# EAGLE design Schematic_Novek (EAGLE 9.6.2)

## Sheet 1 of 3
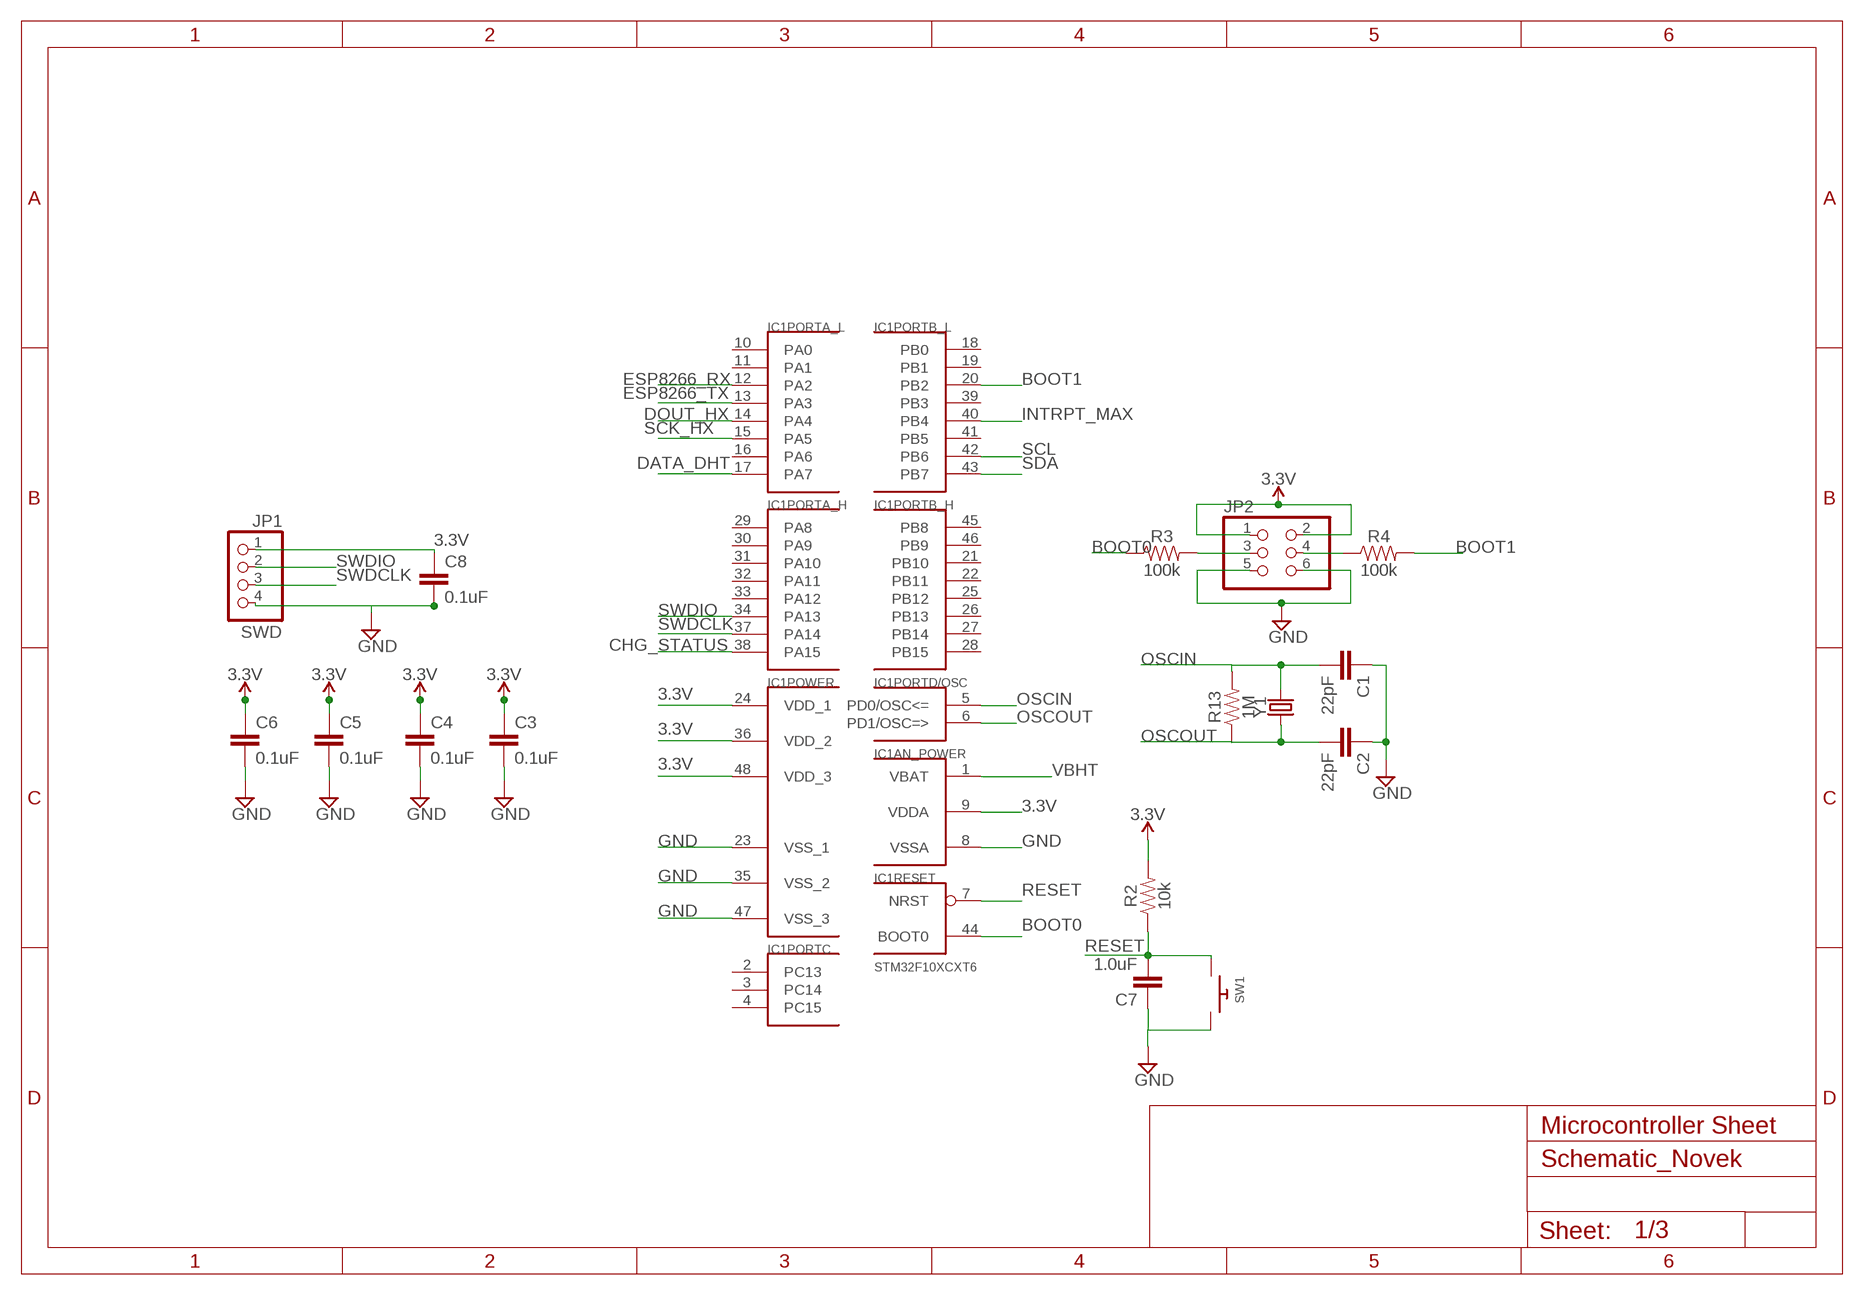
[diagram p0: schematic, sheet 1]

### Parts
C1  22pF  22PF-0603-50V-5%  [0603]
C2  22pF  22PF-0603-50V-5%  [0603]
C3  0.1uF  0.1UF-0603-25V-(+80/-20%)  [0603]
C4  0.1uF  0.1UF-0603-25V-(+80/-20%)  [0603]
C5  0.1uF  0.1UF-0603-25V-(+80/-20%)  [0603]
C6  0.1uF  0.1UF-0603-25V-(+80/-20%)  [0603]
C7  1.0uF  1.0UF-0603-16V-10%  [0603]
C8  0.1uF  0.1UF-0603-25V-(+80/-20%)  [0603]
IC1  STM32F10XCXT6  [TQFP48]
JP1  SWD  PINHD-1X4/90  [1X04/90]
JP2  PINHD-2X3  [2X03]
R2  10k  10KOHM-0603-1/10W-1%  [0603]
R3  100k  100KOHM-0603-1/10W-1%  [0603]
R4  100k  100KOHM-0603-1/10W-1%  [0603]
R13  1M  1MOHM-0603-1/4W-5%  [0603]
SW1  SWITCH_PUSHBUTTONC&K_KSS  [BTN_CK_KSS]
Y1  CRYSTALPTH-HC49UV  [HC49U]

### Nets
3.3V: C3.1 C4.1 C5.1 C6.1 C8.1 IC1.9(AN_POWER:VDDA) IC1.24(POWER:VDD_1) IC1.36(POWER:VDD_2) IC1.48(POWER:VDD_3) JP1.1 JP2.1 JP2.2 R2.2 ; also sheet 2,3
BOOT0: IC1.44(RESET:BOOT0) R3.1
BOOT1: IC1.20(PORTB_L:PB2) R4.2
CHG_STATUS: IC1.38(PORTA_H:PA15) ; also sheet 2
DATA_DHT: IC1.17(PORTA_L:PA7) ; also sheet 3
DOUT_HX: IC1.14(PORTA_L:PA4) ; also sheet 3
ESP8266_RX: IC1.12(PORTA_L:PA2) ; also sheet 3
ESP8266_TX: IC1.13(PORTA_L:PA3) ; also sheet 3
GND: C1.1 C2.1 C3.2 C4.2 C5.2 C6.2 C7.1 C8.2 IC1.8(AN_POWER:VSSA) IC1.23(POWER:VSS_1) IC1.35(POWER:VSS_2) IC1.47(POWER:VSS_3) JP1.4 JP2.5 JP2.6 SW1.P$2 ; also sheet 2,3
INTRPT_MAX: IC1.40(PORTB_L:PB4) ; also sheet 2
N$3: JP2.3 R3.2
N$4: JP2.4 R4.1
OSCIN: C1.2 IC1.5(PORTD/OSC:PD0/OSC<=) R13.2 Y1.2
OSCOUT: C2.2 IC1.6(PORTD/OSC:PD1/OSC=>) R13.1 Y1.1
RESET: C7.2 IC1.7(RESET:NRST) R2.1 SW1.P$1
SCK_HX: IC1.15(PORTA_L:PA5) ; also sheet 3
SCL: IC1.42(PORTB_L:PB6) ; also sheet 2,3
SDA: IC1.43(PORTB_L:PB7) ; also sheet 2,3
SWDCLK: IC1.37(PORTA_H:PA14) JP1.3
SWDIO: IC1.34(PORTA_H:PA13) JP1.2
VBHT: IC1.1(AN_POWER:VBAT)
Unconnected: IC1.2(PORTC:PC13) IC1.3(PORTC:PC14) IC1.4(PORTC:PC15) IC1.10(PORTA_L:PA0) IC1.11(PORTA_L:PA1) IC1.16(PORTA_L:PA6) IC1.18(PORTB_L:PB0) IC1.19(PORTB_L:PB1) IC1.21(PORTB_H:PB10) IC1.22(PORTB_H:PB11) IC1.25(PORTB_H:PB12) IC1.26(PORTB_H:PB13) IC1.27(PORTB_H:PB14) IC1.28(PORTB_H:PB15) IC1.29(PORTA_H:PA8) IC1.30(PORTA_H:PA9) IC1.31(PORTA_H:PA10) IC1.32(PORTA_H:PA11) IC1.33(PORTA_H:PA12) IC1.39(PORTB_L:PB3) IC1.41(PORTB_L:PB5) IC1.45(PORTB_H:PB8) IC1.46(PORTB_H:PB9)

### Notes on the sheet
- Microcontroller Sheet

## Sheet 2 of 3
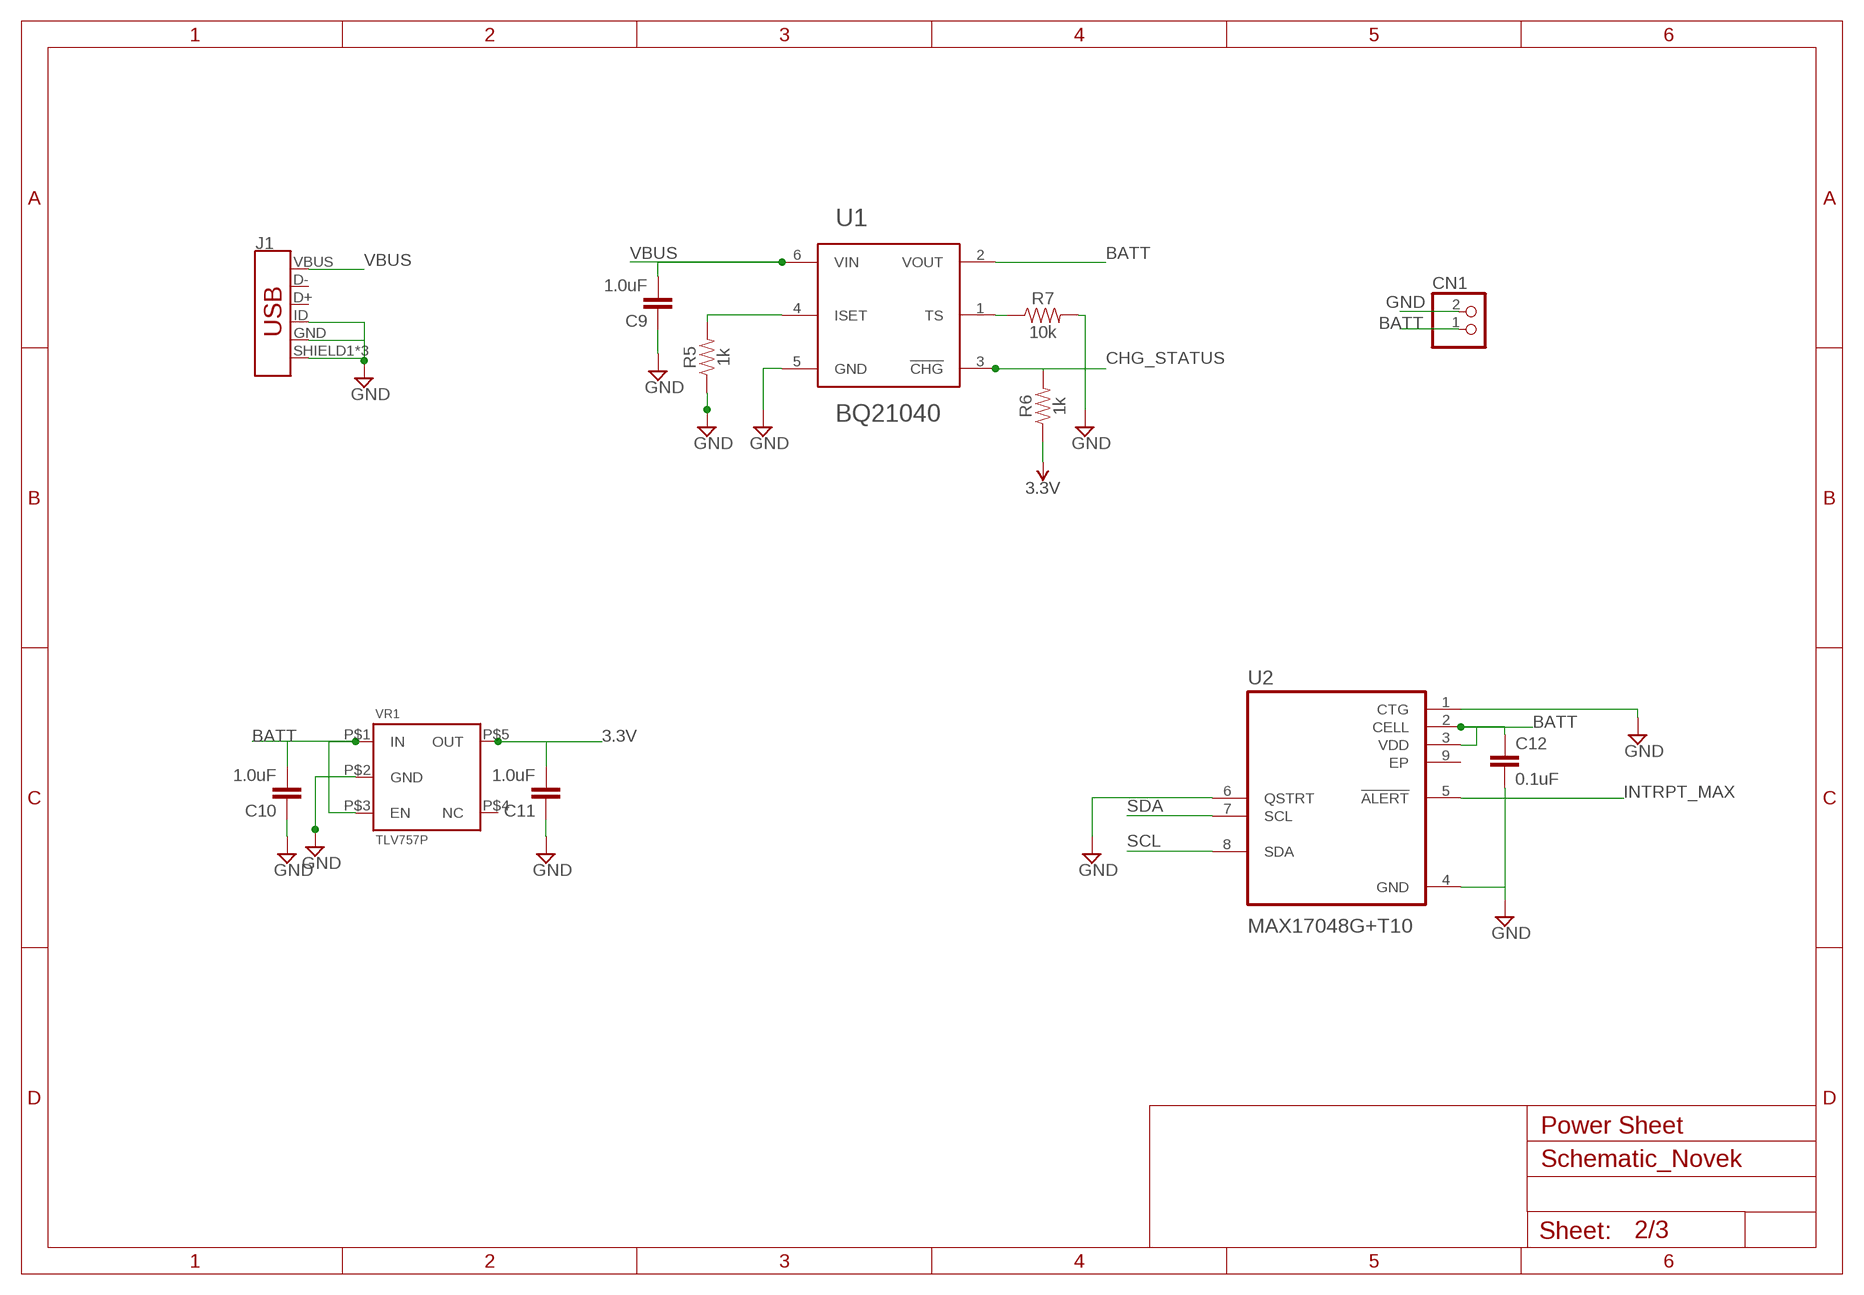
[diagram p1: schematic, sheet 2]

### Parts
C9  1.0uF  1.0UF-0603-16V-10%  [0603]
C10  1.0uF  1.0UF-0603-16V-10%  [0603]
C11  1.0uF  1.0UF-0603-16V-10%  [0603]
C12  0.1uF  0.1UF-0603-25V-(+80/-20%)  [0603]
CN1  JST_2PIN-THM  [JST-PH-2-THM]
J1  USB_MICRO-B_FEMALE-SMT  [USB-B-MICRO-SMD]
R5  1k  1KOHM-0603-1/10W-1%  [0603]
R6  1k  1KOHM-0603-1/10W-1%  [0603]
R7  10k  10KOHM-0603-1/10W-1%  [0603]
U1  BQ21040  [SOT23-6]
U2  MAX17048G+T10  [SON50P200X200X80-9N]
VR1  TLV757P  [TLV757P]

### Nets
3.3V: C11.2 R6.1 VR1.P$5(OUT) ; also sheet 1,3
BATT: C10.2 C12.1 CN1.1 U1.2(VOUT) U2.2(CELL) U2.3(VDD) VR1.P$1(IN) VR1.P$3(EN)
CHG_STATUS: R6.2 U1.3(!CHG!) ; also sheet 1
GND: C9.1 C10.1 C11.1 C12.2 CN1.2 J1.GND J1.ID J1.SHIELD1(SHIELD) J1.SHIELD2(SHIELD) J1.SHIELD3(SHIELD) R5.1 R7.2 U1.5(GND) U2.1(CTG) U2.4(GND) U2.6(QSTRT) VR1.P$2(GND) ; also sheet 1,3
INTRPT_MAX: U2.5(!ALERT) ; also sheet 1
N$1: R5.2 U1.4(ISET)
N$2: R7.1 U1.1(TS)
SCL: U2.8(SDA) ; also sheet 1,3
SDA: U2.7(SCL) ; also sheet 1,3
VBUS: C9.2 J1.VBUS U1.6(VIN)
Unconnected: J1.D+ J1.D- VR1.P$4(NC)

### Notes on the sheet
- Power Sheet

## Sheet 3 of 3
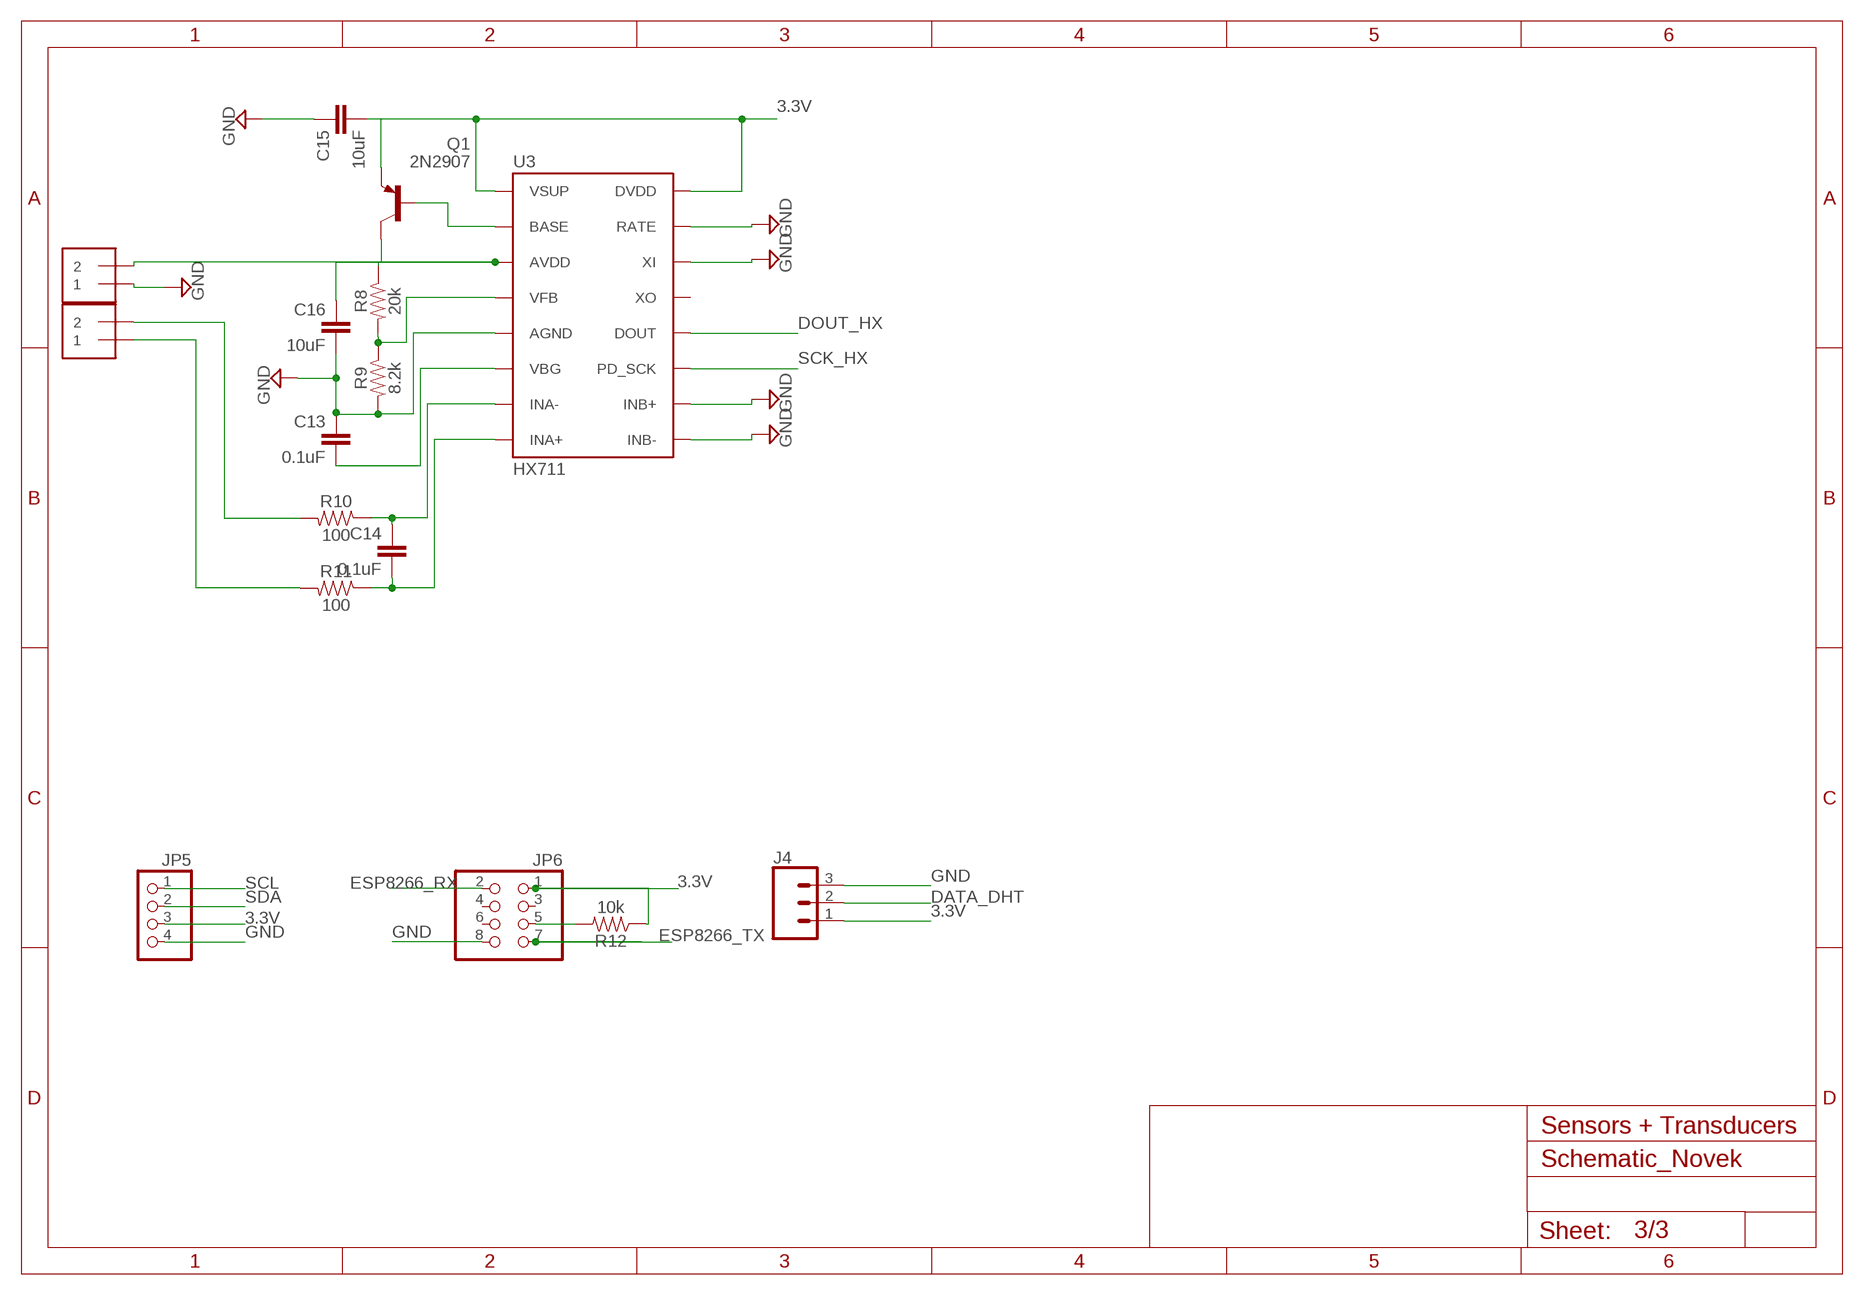
[diagram p2: schematic, sheet 3]

### Parts
C13  0.1uF  0.1UF-0603-25V-5%  [0603]
C14  0.1uF  0.1UF-0603-25V-5%  [0603]
C15  10uF  10UF-0603-6.3V-20%  [0603]
C16  10uF  10UF-0603-6.3V-20%  [0603]
J2  1X2-3.5MM  [1X2-3.5MM]
J3  1X2-3.5MM  [1X2-3.5MM]
J4  CONN_03JST-PTH  [JST-3-PTH]
JP5  PINHD-1X4  [1X04]
JP6  PINHD-2X4  [2X04]
Q1  2N2907  [TO92-EBC-OVAL]
R8  20k  20KOHM-0603-1/10W-1%  [0603]
R9  8.2k  8.2KOHM-0603-1/10W-5%  [0603]
R10  100  100OHM-0603-1/10W-1%  [0603]
R11  100  100OHM-0603-1/10W-1%  [0603]
R12  10k  10KOHM-0603-1/10W-1%  [0603]
U3  HX711  [SO16]

### Nets
3.3V: C15.2 J4.1 JP5.3 JP6.1 Q1.E R12.1 U3.1(VSUP) U3.16(DVDD) ; also sheet 1,2
DATA_DHT: J4.2 ; also sheet 1
DOUT_HX: U3.12(DOUT) ; also sheet 1
ESP8266_RX: JP6.2 ; also sheet 1
ESP8266_TX: JP6.7 ; also sheet 1
GND: C13.1 C15.1 C16.2 J2.1 J4.3 JP5.4 JP6.8 R9.2 U3.5(AGND) U3.9(INB-) U3.10(INB+) U3.14(XI) U3.15(RATE) ; also sheet 1,2
N$5: Q1.B U3.2(BASE)
N$6: JP6.5 R12.2
N$7: C16.1 J2.2 Q1.C R8.1 U3.3(AVDD)
N$8: J3.2 R10.2
N$9: J3.1 R11.2
N$10: C13.2 U3.6(VBG)
N$11: R8.2 R9.1 U3.4(VFB)
N$12: C14.1 R10.1 U3.7(INA-)
N$13: C14.2 R11.1 U3.8(INA+)
SCK_HX: U3.11(PD_SCK) ; also sheet 1
SCL: JP5.1 ; also sheet 1,2
SDA: JP5.2 ; also sheet 1,2
Unconnected: JP6.3 JP6.4 JP6.6 U3.13(XO)

### Notes on the sheet
- Sensors + Transducers

## Power pins joined to a net without a drawn wire
EP: U2.9(EP)

## Library data of the parts
C1 C2 = SparkFun-Capacitors:22PF: 22pF ceramic capacitors A capacitor is a passive two-terminal electrical component used to store electrical energy temporarily in an electric field.; PROD_ID: CAP-07876
C3-C6 C8 C12 = SparkFun-Capacitors:0.1UF: 0.1µF ceramic capacitors A capacitor is a passive two-terminal electrical component used to store electrical energy temporarily in an electric field.; PROD_ID: CAP-00810
C7 C9-C11 = SparkFun-Capacitors:1.0UF: 1µF ceramic capacitors A capacitor is a passive two-terminal electrical component used to store electrical energy temporarily in an electric field.; PROD_ID: CAP-00868
C13 C14 = SparkFun-Capacitors:0.1UF: 0.1µF ceramic capacitors A capacitor is a passive two-terminal electrical component used to store electrical energy temporarily in an electric field.; PROD_ID: CAP-08604
C15 C16 = SparkFun-Capacitors:10UF: 10.0µF ceramic capacitors A capacitor is a passive two-terminal electrical component used to store electrical energy temporarily in an electric field.; PROD_ID: CAP-11015
CN1 = adafruit:JST_2PIN: JST 2-Pin Connectors of various flavors SMT-RA (S2B-PH-SM4) 4UConnector #17311 SMT (B2B-PH-SM4) THM-RA (S2B-PH) THM (B2B-PH)
IC1 = stm32:STM32F10XCXT6: ST STM32F101/103 48pin LQFP
J1 = SparkFun-Connectors:USB_MICRO-B: USB Type Micro-B Connector Male/female and PTH/SMT variants SparkFun Products: SparkFun microB USB Breakout <https://www.sparkfun.com/products/12035> SparkFun USB microB Plug Breakout <https://www.sparkfun.com/products/10031> SparkFun ESP8266 Thing <https://www.sparkfun.com/products/13231>; PROD_ID: CONN-11752
J2 J3 = adafruit:1X2: 3.5mm Terminal block http://www.ladyada.net/library/pcb/eaglelibrary.html
J4 = SparkFun-Connectors:CONN_03: Multi connection point. Often used as Generic Header-pin footprint for 0.1 inch spaced/style header connections On any of the 0.1 inch spaced packages, you can populate with these: Break Away Headers - Straight <https://www.sparkfun.com/products/116> (PRT-00116) Break Away Male Headers - Right Angle <https://www.sparkfun.com/products/553> (PRT-00553) Female Headers <https://www.sparkfun.com/products/115> (PRT-00115) Break Away Headers - Machine Pin <https://www.sparkfun.com/products/117> (PRT-00117) Break Away Female Headers - Swiss Machine Pin <https://www.sparkfun.com/products/743> (PRT-00743) Stackable Header - 3 Pin (Female, 0.1") <https://www.sparkfun.com/products/13875> (PRT-13875) For SCREWTERMINALS and SPRING TERMINALS visit here: Screw Terimnals on SparkFun.com <https://www.sparkfun.com/search/results?term=Screw+Terminals> (5mm/3.5mm/2.54mm spacing) This device is also useful as a general connection point to wire up your design to another part of your project. Our various solder wires solder well into these plated through hole pads. Hook-Up Wire - Assortment (Stranded, 22 AWG) <https://www.sparkfun.com/products/11375> (PRT-11375) Hook-Up Wire - Assortment (Solid Core, 22 AWG) <https://www.sparkfun.com/products/11367> (PRT-11367) View the entire wire category on our website here <https://www.sparkfun.com/categories/141> Special notes: Molex polarized connector foot print use with SKU : PRT-08232 with associated crimp pins and housings.; PROD_ID: WIRE-10037; SF_ID: PRT-09915
JP1 JP5 = pinhead:PINHD-1X4: PIN HEADER
JP2 = pinhead:PINHD-2X3: PIN HEADER
JP6 = pinhead:PINHD-2X4: PIN HEADER
Q1 = adafruit:2N2907*: PNP Transistor Big Oval pads
R2 R7 R12 = SparkFun-Resistors:10KOHM: 10kΩ resistor A resistor is a passive two-terminal electrical component that implements electrical resistance as a circuit element. Resistors act to reduce current flow, and, at the same time, act to lower voltage levels within circuits. - Wikipedia; PROD_ID: RES-00824
R3 R4 = SparkFun-Resistors:100KOHM: 100kΩ resistor A resistor is a passive two-terminal electrical component that implements electrical resistance as a circuit element. Resistors act to reduce current flow, and, at the same time, act to lower voltage levels within circuits. - Wikipedia; PROD_ID: RES-07828
R5 R6 = SparkFun-Resistors:1KOHM: 1kΩ resistor A resistor is a passive two-terminal electrical component that implements electrical resistance as a circuit element. Resistors act to reduce current flow, and, at the same time, act to lower voltage levels within circuits. - Wikipedia; PROD_ID: RES-07856
R8 = SparkFun-Resistors:20KOHM: 20kΩ resistor A resistor is a passive two-terminal electrical component that implements electrical resistance as a circuit element. Resistors act to reduce current flow, and, at the same time, act to lower voltage levels within circuits. - Wikipedia; PROD_ID: RES-09383
R9 = SparkFun-Resistors:8.2KOHM: 8.2kΩ resistor A resistor is a passive two-terminal electrical component that implements electrical resistance as a circuit element. Resistors act to reduce current flow, and, at the same time, act to lower voltage levels within circuits. - Wikipedia; PROD_ID: RES-10646
R10 R11 = SparkFun-Resistors:100OHM: 100Ω resistor A resistor is a passive two-terminal electrical component that implements electrical resistance as a circuit element. Resistors act to reduce current flow, and, at the same time, act to lower voltage levels within circuits. - Wikipedia; PROD_ID: RES-07863
R13 = SparkFun-Resistors:1MOHM: 1MΩ resistor A resistor is a passive two-terminal electrical component that implements electrical resistance as a circuit element. Resistors act to reduce current flow, and, at the same time, act to lower voltage levels within circuits. - Wikipedia; PROD_ID: RES-07868
SW1 = adafruit:SWITCH_PUSHBUTTON: Buttons SOFTTOUCHSMD_SJ - Soft touch temporary push button (Super Junk Akihabara) Compatible with SKPMANE010 [Mouser: 688-SKPMAN] C&K_KSS = Digikey: KSS221GLFS
U1 = bq21040:BQ21040: The bq21040 device is a highly integrated Li-Ion and Li-Pol linear battery charger device targeted at spacelimited portable applications. The device operates from either a USB port or AC adapter. The high input voltage range with input overvoltage protection supports low-cost unregulated adapters.
U2 = MAX17048G_T10:MAX17048G+T10: Check prices <https://pricing.snapeda.com/parts/MAX17048G%2BT10/Maxim%20Integrated/view-part?ref=eda>; AVAILABILITY: Warning; DESCRIPTION: Battery Battery Monitor IC Lithium Ion 8-TDFN-EP (2x2); MF: Maxim Integrated; MP: MAX17048G+T10; PACKAGE: TDFN-8 Maxim; PRICE: None; PURCHASE-URL: https://pricing.snapeda.com/search/part/MAX17048G+T10/?ref=eda
U3 = SparkFun-IC-Conversion:HX711: AVIA Semiconductor HX711 - ADC 24-Bit Analog-to-Digital Converter for Weigh Scales Datasheet <https://cdn.sparkfun.com/datasheets/Sensors/ForceFlex/hx711_english.pdf> SparkFun Products: SparkFun Load Cell Amplifier - HX711 <https://www.sparkfun.com/products/13879>; PROD_ID: IC-12445
VR1 = TLV757P:TLV757P: 3.3V 1A Regulator Check prices <https://pricing.snapeda.com/parts/TLV757P/Texas%20Instruments/view-part?ref=eda>; AVAILABILITY: Bad; DESCRIPTION: LDO Voltage Regulators; MF: Texas Instruments; MP: TLV757P; PACKAGE: Package; PRICE: None
Y1 = SparkFun-Clocks:CRYSTAL: Crystals (Generic) These are passive quartz crystals, which can be used as a clock source for a microcontroller. Crystal's are two-terminal devices. They require external "load" capacitors to generate an oscillating signal.

## Board
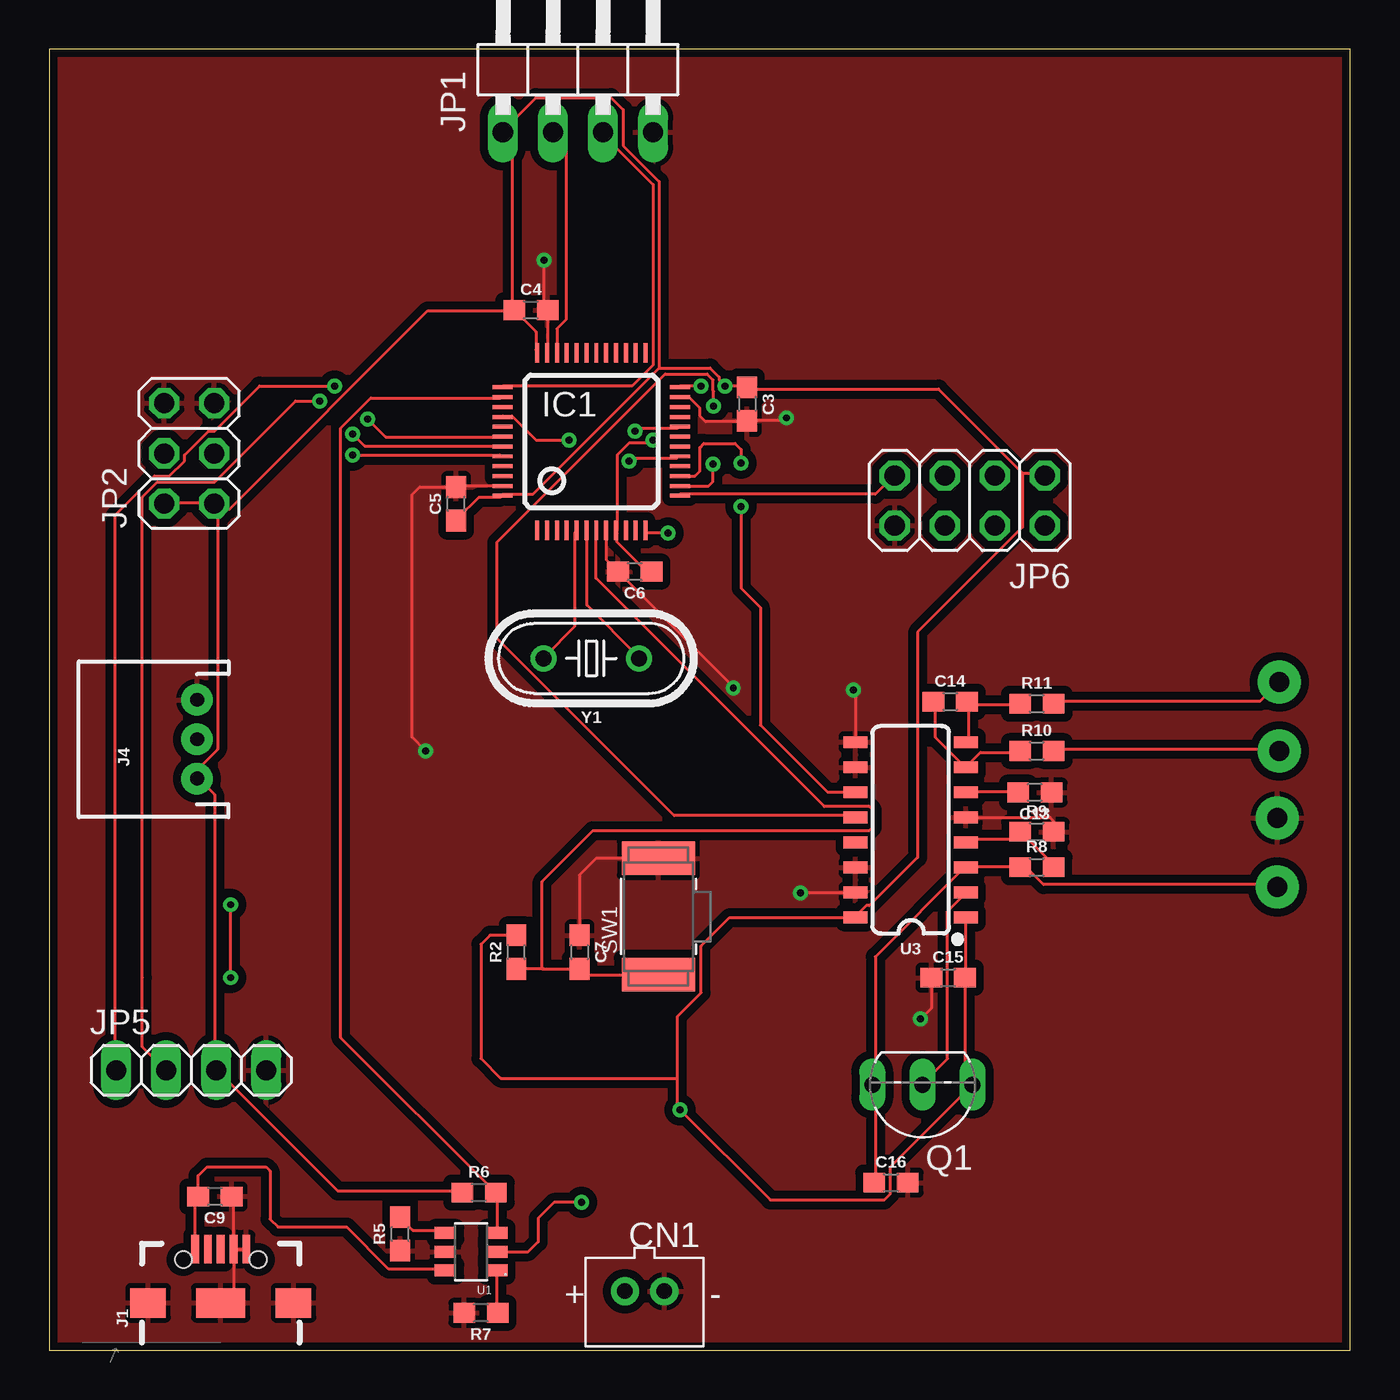
[diagram p3: board, top side]
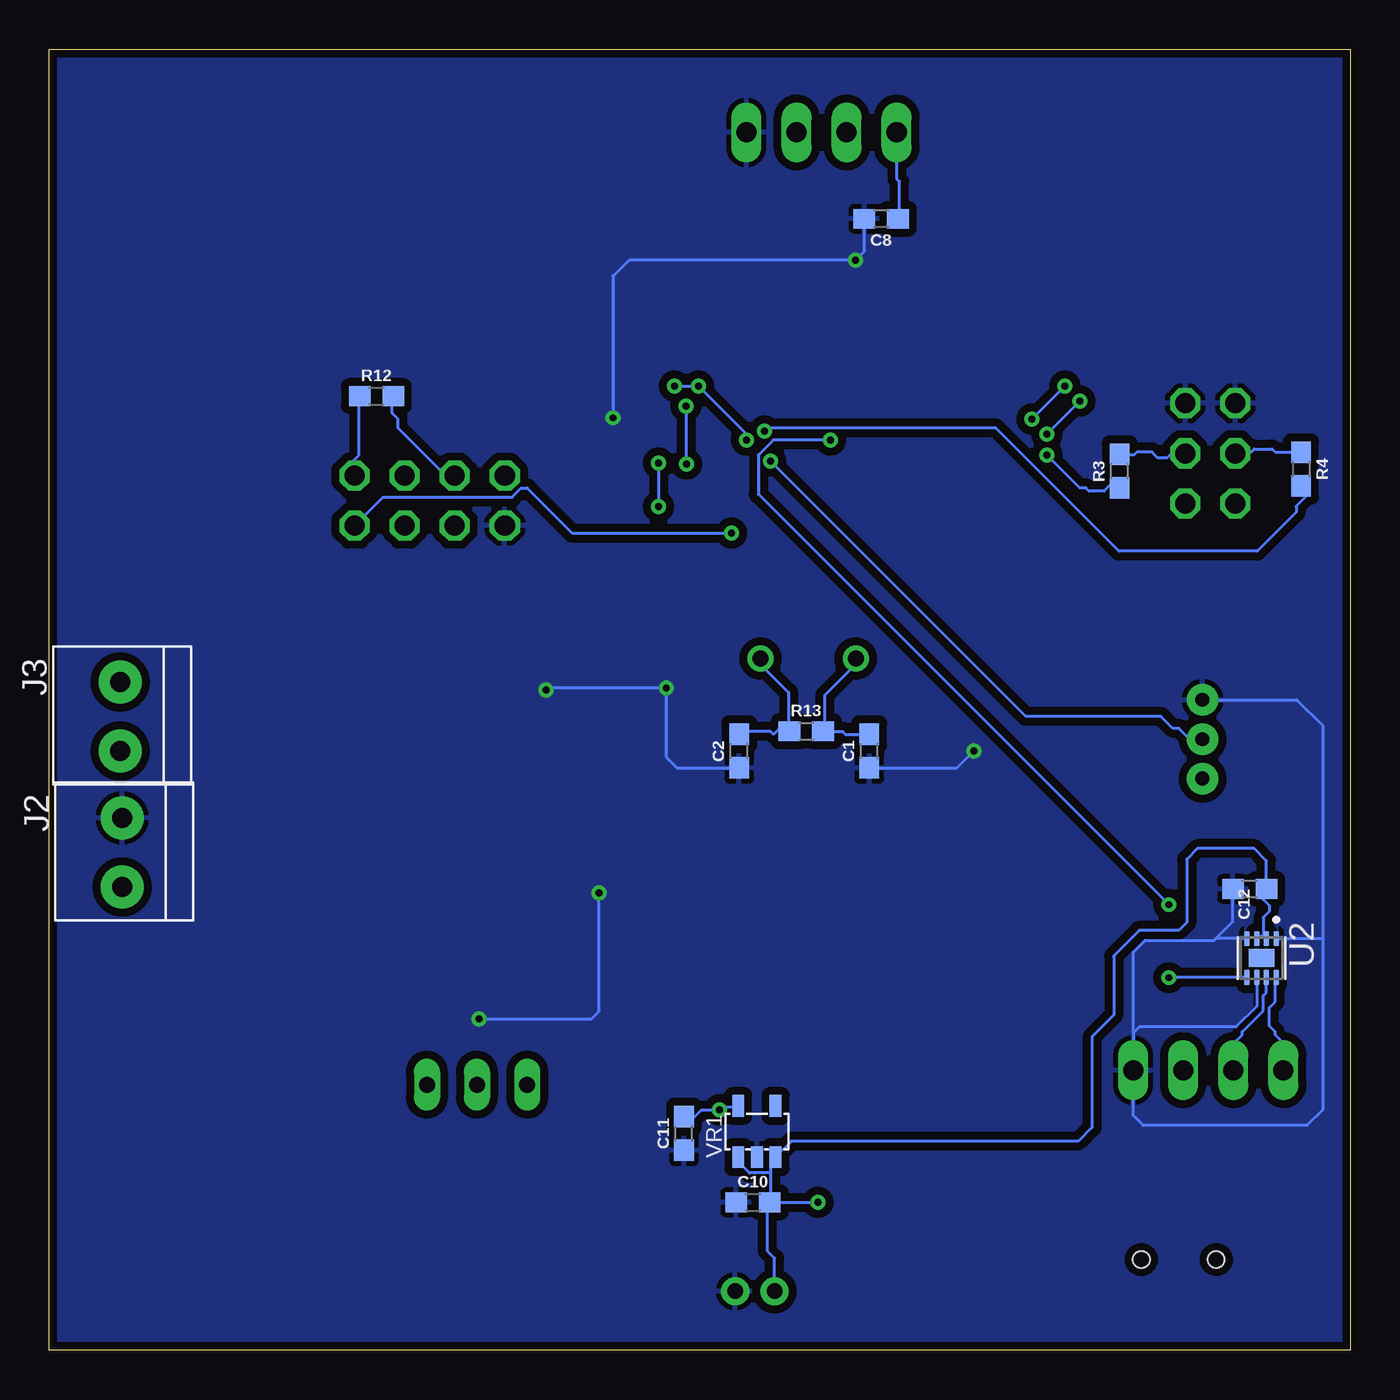
[diagram p4: board, bottom side, seen from below]

Size 66 x 66 mm. Coordinates in mm from the lower left corner, seen from the top.
Outline: 0,0 66,0 66,66 0,66 0,0
Copper layers (1*16): Top 0.035mm / dielectric 1.5mm / Bottom 0.035mm
Design rules "default *": minimum track width 6mil, minimum drill 0.35mm, track to track 6mil, track to pad 6mil, pad to pad 6mil, via to via 6mil, smd to smd 6mil, copper to edge 6mil, drill to drill 6mil, minimum pad ring 10mil, minimum via ring 8mil, stop-mask expansion 4mil, vias tented up to drill 0mil, thermal gap 10mil

### Footprints (pad centres in the part's own frame; a part is rotated, then mirrored left to right if it is on the bottom)
0603 = smd 1.1 x 1: 1 -0.85,0; 2 0.85,0
JST-PH-2-THM = drill 0.8 pad 1.422: 1 1,0; 2 -1,0
TQFP48 = smd 0.2 x 1: 1 -2.75,-4.5; 2 -2.25,-4.5; 3 -1.75,-4.5; 4 -1.25,-4.5; 5 -0.75,-4.5; 6 -0.25,-4.5; 7 0.25,-4.5; 8 0.75,-4.5; 9 1.25,-4.5; 10 1.75,-4.5; 11 2.25,-4.5; 12 2.75,-4.5; 25 2.75,4.5; 26 2.25,4.5; 27 1.75,4.5; 28 1.25,4.5; 29 0.75,4.5; 30 0.25,4.5; 31 -0.25,4.5; 32 -0.75,4.5; 33 -1.25,4.5; 34 -1.75,4.5; 35 -2.25,4.5; 36 -2.75,4.5 | smd 1 x 0.2: 13 4.5,-2.75; 14 4.5,-2.25; 15 4.5,-1.75; 16 4.5,-1.25; 17 4.5,-0.75; 18 4.5,-0.25; 19 4.5,0.25; 20 4.5,0.75; 21 4.5,1.25; 22 4.5,1.75; 23 4.5,2.25; 24 4.5,2.75; 37 -4.5,2.75; 38 -4.5,2.25; 39 -4.5,1.75; 40 -4.5,1.25; 41 -4.5,0.75; 42 -4.5,0.25; 43 -4.5,-0.25; 44 -4.5,-0.75; 45 -4.5,-1.25; 46 -4.5,-1.75; 47 -4.5,-2.25; 48 -4.5,-2.75
USB-B-MICRO-SMD = smd 1.45 x 0.4: D+ 2.725,0; D- 2.725,0.65; GND 2.725,-1.3; ID 2.725,-0.65; VBUS 2.725,1.3 | smd 1.5 x 1.8: SHIELD1 0,3.685; SHIELD2 0,-3.685 | smd 1.5 x 2.5: SHIELD3 0,0 | hole 0.85: 2.2,1.9; 2.2,-1.9
1X2-3.5MM = drill 1 pad 2.184: 1 1.8,0; 2 -1.7,0
JST-3-PTH = drill 0.7 pad 1.6: 1 -2,0; 2 0,0; 3 2,0
1X04/90 = drill 1.016 long: 1 -3.81,-3.81; 2 -1.27,-3.81; 3 1.27,-3.81; 4 3.81,-3.81
2X03 = drill 1.016 octagon: 1 -2.54,-1.27; 2 -2.54,1.27; 3 0,-1.27; 4 0,1.27; 5 2.54,-1.27; 6 2.54,1.27
1X04 = drill 1.016 long: 1 -3.81,0; 2 -1.27,0; 3 1.27,0; 4 3.81,0
2X04 = drill 1.016 octagon: 1 -3.81,-1.27; 2 -3.81,1.27; 3 -1.27,-1.27; 4 -1.27,1.27; 5 1.27,-1.27; 6 1.27,1.27; 7 3.81,-1.27; 8 3.81,1.27
TO92-EBC-OVAL = drill 0.813 long: B 0,-1.27; C 2.54,-1.27; E -2.54,-1.27
BTN_CK_KSS = smd 1.7 x 3.7: P$1 -2.95,0; P$2 2.95,0
SOT23-6 = smd 1.1 x 0.6: 1 -1.3,0.95; 2 -1.3,0; 3 -1.3,-0.95; 4 1.3,-0.95; 5 1.3,0; 6 1.3,0.95
SON50P200X200X80-9N = smd 0.76 x 0.27: 1 -0.985,0.75; 2 -0.985,0.25; 3 -0.985,-0.25; 4 -0.985,-0.75; 5 0.985,-0.75; 6 0.985,-0.25; 7 0.985,0.25; 8 0.985,0.75 | smd 0.9 x 1.3: 9 0,0
SO16 = smd 0.6 x 1.2: 1 -4.445,-2.8; 2 -3.175,-2.8; 3 -1.905,-2.8; 4 -0.635,-2.8; 5 0.635,-2.8; 6 1.905,-2.8; 7 3.175,-2.8; 8 4.445,-2.8; 9 4.445,2.8; 10 3.175,2.8; 11 1.905,2.8; 12 0.635,2.8; 13 -0.635,2.8; 14 -1.905,2.8; 15 -3.175,2.8; 16 -4.445,2.8
TLV757P = smd 1.1 x 0.6: P$1 -1.3,0.95; P$2 -1.3,0; P$3 -1.3,-0.95; P$4 1.3,-0.95; P$5 1.3,0.95
HC49U = drill 0.813: 1 -2.413,0; 2 2.413,0

### Placement (x,y rotation side)
C1  24.4,30.4 90 bottom
C2  31,30.4 90 bottom
C3  35.4,48 270 top
C4  24.44,52.77 0 top
C5  20.64,42.94 90 top
C6  29.7,39.5 180 top
C7  26.9,20.2 270 top
C8  23.8,57.4 180 bottom
C9  8.4,7.8 180 top
C10  30.3,7.5 0 bottom
C11  33.8,11 90 bottom
C12  5.1,23.4 180 bottom
C13  50,28.3 180 top
C14  45.7,32.9 0 top
C15  45.6,18.9 0 top
C16  42.7,8.5 0 top
CN1  30.2,3 180 top
IC1  27.5,46.1 0 top
J1  8.7,2.4 90 top
J2  62.3,25.2 90 bottom
J3  62.4,32.1 90 bottom
J4  7.5,31 90 top
JP1  26.82,65.6 0 top
JP2  7.1,45.5 90 top
JP5  7.2,14.2 0 top
JP6  46.7,43.1 180 top
Q1  44.3,12.2 180 top
R2  23.7,20.2 90 top
R3  11.7,44.6 90 bottom
R4  2.5,44.7 270 bottom
R5  17.8,5.9 90 top
R6  21.8,8 0 top
R7  21.9,1.9 180 top
R8  50.1,24.5 0 top
R9  50.1,26.3 0 top
R10  50.1,30.4 0 top
R11  50.1,32.8 0 top
R12  49.4,48.4 0 bottom
R13  27.6,31.4 0 bottom
SW1  30.9,22 90 top
U1  21.4,5 180 top
U2  4.5,19.9 270 bottom
U3  43.7,26.4 90 top
VR1  30.1,11.1 90 bottom
Y1  27.5,35.1 180 top

### Tracks (layer width: path | path; a pad name or v marks a point on that pad's centre or on a via)
3.3V  (via drill 0.35)
  Top 0.152: U3.1 46.48,21.95 46.48,19.05 C15.2 46.48,18.9 46.48,13.87 46.79,13.56 Q1.E 46.79,13.41 42.67,9.3 42.67,7.92 42.37,7.62 36.58,7.62 v32,12.19 31.85,12.19 31.85,13.8 | 31.85,13.8 31.85,16.92 33.07,18.14 33.07,20.5 34.52,21.95 40.84,21.95 U3.16 41,22.1 41.45,22.55 41.6,22.55 44.04,24.99 44.04,36.42 49.38,41.76 49.38,44.5 | C6.1 30.48,39.62 30.18,39.62 28.8,41 28.8,41.45 IC1.9 28.8,41.6 28.8,45.41 29.41,46.02 30.48,46.02 v30.63,46.18 | v33.07,48.92 32,48.92 IC1.24 | C5.1 20.73,42.22 21.79,43.28 22.86,43.28 IC1.48 23.01,43.43 24.54,43.43 30.94,49.84 | 30.94,49.84 33.53,49.84 33.98,49.38 33.98,49.23 v34.29,48.92 35.36,48.92 C3.1 35.51,48.77 45.11,48.77 49.38,44.5 | 49.38,44.5 50.44,44.5 JP6.1 | R6.1 20.88,8.08 14.63,8.08 8.53,14.17 JP5.3 8.38,14.33 8.38,28.19 7.62,28.96 J4.1 7.62,29.11 7.62,29.57 8.53,30.48 8.53,42.67 | IC1.36 24.69,50.75 24.69,51.66 23.62,52.73 C4.1 | C4.1 23.47,52.88 23.47,61.27 23.01,61.72 JP1.1 23.01,61.87 24.69,63.55 28.5,63.55 29.11,62.94 29.11,61.11 30.94,59.28 30.94,49.84 | JP2.2 5.94,42.98 8.23,42.98 JP2.1 | 8.53,42.67 8.38,42.82 JP2.1 | 8.53,42.67 9.14,42.67 19.2,52.73 23.47,52.73 C4.1 | 8.53,42.67 JP2.1 | 31.85,13.8 22.9,13.8 21.9,14.8 21.9,20.6 22.35,21.05 R2.2
  Bottom 0.152: VR1.P$5 31.09,12.34 31.85,12.34 v32,12.19 32.92,12.19 33.38,11.73 33.68,11.73 C11.2 | R12.1 50.29,48.31 50.29,45.41 50.6,45.11 50.6,44.5 JP6.1 | v34.29,48.92 v33.07,48.92 30.63,46.48 v30.63,46.18 | C8.1 22.86,57.45 22.86,59.28 23.01,59.44 23.01,61.72 JP1.1
BATT  (via drill 0.35)
  Top 0.152: v27,7.5 25.6,7.5 24.8,6.7 24.8,5.5 24.3,5 U1.2
  Bottom 0.152: 29.41,8.99 29.41,9.6 29.26,9.75 VR1.P$3 28.35,10.6 13.8,10.6 13.1,11.3 13.1,15.9 12,17 12,20 10.7,21.3 8.7,21.3 8.3,21.7 8.3,24.9 7.75,25.45 4.88,25.45 4.25,24.82 C12.1 4.27,23.32 4.42,23.16 4.42,22.86 4.12,22.55 4.12,22.25 4.42,21.95 4.42,21.03 | 29.41,8.99 29.41,7.62 C10.2 | 29.41,8.99 30.48,8.99 30.94,9.45 30.94,9.75 VR1.P$1 | C10.2 29.57,7.47 29.57,5.03 29.2,4.66 CN1.1 | 4.42,21.03 4.72,21.03 U2.3 | 4.42,21.03 4.27,21.03 U2.2 | C10.2 v27,7.5
BOOT0  (via drill 0.35)
  Top 0.152: v15.39,45.41 22.86,45.41 IC1.44
  Bottom 0.152: v15.39,45.41 13.72,43.74 13.41,43.74 13.26,43.59 12.5,43.59 12.19,43.89 11.73,43.89 R3.1
BOOT1  (via drill 0.35)
  Top 0.152: v29.72,46.63 29.87,46.79 31.85,46.79 IC1.20
  Bottom 0.152: v29.72,46.63 29.57,46.79 17.98,46.79 11.73,40.54 4.72,40.54 2.74,42.52 2.74,42.82 2.29,43.28 2.29,43.59 2.44,43.74 R4.2
CHG_STATUS
  Top 0.152: IC1.38 22.86,48.31 16.31,48.31 14.78,46.79 14.78,15.85 22.55,8.08 R6.2 22.71,7.92 22.71,6.1 U1.3
DATA_DHT  (via drill 0.35)
  Top 0.152: v29.41,45.11 29.57,45.26 31.85,45.26 IC1.17
  Bottom 0.152: v29.41,45.11 16.46,32.16 9.6,32.16 8.99,31.55 8.69,31.55 8.23,31.09 7.62,31.09 J4.2
DOUT_HX  (via drill 0.35)
  Top 0.152: v33.68,44.96 33.66,44.94 33.66,44.06 33.45,43.85 IC1.14 | U3.12 40.84,27.13 31.7,27.13 22.71,36.12 22.71,41 31.24,49.53 33.38,49.53 33.68,49.23 33.68,48.67 33.7,48.65 v33.7,47.9
  Bottom 0.152: v33.68,44.96 33.68,47.88 v33.7,47.9
ESP8266_RX  (via drill 0.35)
  Top 0.152: v31.39,41.45 30.33,41.45 IC1.12
  Bottom 0.152: v31.39,41.45 39.47,41.45 41.76,43.74 42.06,43.74 42.52,43.28 49.07,43.28 50.44,41.91 JP6.2
ESP8266_TX
  Top 0.152: IC1.13 32,43.43 41.91,43.43 42.82,44.35 JP6.7
GND  (via drill 0.35)
  Top 0.152: SW1.P$2 27.75,24.95 26.9,24.1 C7.1 | U3.5 50.77,27.04 50.95,26.85 R9.2 | IC1.35 25.29,50.64 C4.2 25.1,52.96 v25.1,55.3 | v37.4,47.3 37.25,47.15 C3.2 35.35,47.1 33.3,47.1 33,47.4 33,47.8 32.45,48.35 IC1.23 | IC1.47 20.7,43.85 C5.2 18.79,43.79 18.4,43.4 18.4,31.1 v19.1,30.4 | IC1.8 28.25,40.1 C6.2 34.7,33.65 v34.7,33.6 | v40.8,33.5 40.9,33.4 U3.9 | J1.ID 9.35,7.7 C9.1 | J1.ID J1.GND | J1.ID 9.35,3.05 J1.SHIELD3 | C15.1 44.75,17.35 v44.2,16.8 | v38.1,23.2 38.12,23.23 U3.15
  Bottom 0.152: U2.6 4.75,17.45 5.8,16.4 10.7,16.4 11.01,16.09 | 11.01,16.09 JP5.4 11.01,11.91 10.5,11.4 2.2,11.4 1.4,12.2 1.4,20.9 | 11.01,16.09 11.01,20.19 10.4,20.8 6.9,20.8 6.82,20.89 | 6.82,20.89 5.95,21.75 C12.2 | C8.2 24.65,55.75 v25.1,55.3 36.6,55.3 37.4,54.5 v37.4,47.3 | C2.1 34.15,29.55 34.7,30.1 v34.7,33.6 40.7,33.6 v40.8,33.5 | C1.1 19.95,29.55 v19.1,30.4 | U2.4 6.82,20.89 | J4.3 2.7,33 1.4,31.7 1.4,20.9 | v44.2,16.8 38.5,16.8 38.1,17.2 v38.1,23.2 | U2.1 1.42,20.89 1.4,20.9
  pour Top (isolate 0.406): 0,0 66,0 66,66 0,66
  pour Bottom (isolate 0.406): 0,0 66,0 66,66 0,66
INTRPT_MAX  (via drill 0.35)
  Top 0.152: v26.36,46.18 24.69,46.18 23.47,47.4 23.01,47.4 IC1.40 | v9.2,18.9 v9.2,22.6 v9.19,22.61
  Bottom 0.152: v9.19,22.61 30.02,43.43 30.02,45.41 29.26,46.18 v26.36,46.18 | U2.5 9.19,18.91 v9.2,18.9
N$1
  Top 0.152: U1.4 19.96,6.1 18.44,6.1 17.83,6.71 R5.2
N$2
  Top 0.152: U1.1 22.71,3.96 22.71,1.98 R7.1
N$3
  Bottom 0.152: R3.2 11.58,45.41 10.97,45.41 10.82,45.57 10.06,45.57 9.75,45.26 9.3,45.26 9.14,45.41 8.38,45.41 JP2.3
N$4
  Bottom 0.152: R4.1 2.59,45.57 3.81,45.57 3.96,45.72 4.88,45.72 5.03,45.57 5.79,45.57 JP2.4
N$5
  Top 0.152: U3.2 46.48,23.16 45.57,22.25 45.57,14.78 44.35,13.56 Q1.B
N$6
  Bottom 0.152: R12.2 48.62,48.31 48.62,47.55 48.31,47.24 48.31,46.79 46.02,44.5 45.57,44.5 JP6.5
N$7
  Top 0.152: C16.1 41.91,8.53 41.91,13.41 Q1.C 41.91,13.56 41.91,19.96 46.48,24.54 U3.3 46.63,24.54 49.23,24.54 R8.1 49.38,24.38 49.68,24.38 50.44,23.62 62.18,23.62 J2.2
N$8
  Top 0.152: R10.2 51.05,30.48 62.33,30.48 J3.2
N$9
  Top 0.152: R11.2 51.05,32.92 61.42,32.92 62.33,33.83 J3.1
N$10
  Top 0.152: C13.2 49.07,28.35 46.63,28.35 U3.6
N$11
  Top 0.152: R8.2 51.05,24.54 49.38,26.21 R9.1 49.23,26.21 48.92,25.91 46.63,25.91 U3.4
N$12
  Top 0.152: R10.1 49.23,30.33 47.24,30.33 46.63,29.72 U3.7 46.48,29.57 44.96,31.09 44.96,32.77 C14.1
N$13
  Top 0.152: 46.63,32.77 49.23,32.77 R11.1 | 46.63,32.77 46.63,30.94 U3.8 | 46.63,32.77 C14.2
OSCIN
  Top 0.152: IC1.5 26.67,41.45 26.67,36.73 25.15,35.2 Y1.2
  Bottom 0.152: C1.2 24.54,31.24 25.6,31.24 25.76,31.39 26.67,31.39 R13.2 26.67,31.55 26.67,33.22 25.15,34.75 25.15,35.05 Y1.2
OSCOUT
  Top 0.152: IC1.6 27.28,41.45 27.28,37.8 29.87,35.2 Y1.1
  Bottom 0.152: 28.5,31.55 28.96,31.55 29.26,31.24 29.41,31.39 30.94,31.39 C2.2 | 28.5,31.55 28.5,33.38 29.87,34.75 29.87,35.05 Y1.1 | 28.5,31.55 R13.1
RESET
  Top 0.152: IC1.7 27.74,41.45 27.74,39.17 39.32,27.58 41.6,27.58 41.76,27.43 41.76,26.52 41.6,26.36 27.58,26.36 25,23.78 25,19.36 | 25,19.36 25.1,19.36 26.82,19.36 C7.2 26.98,19.2 27.13,19.05 SW1.P$1 | 25,19.36 R2.1
SCK_HX  (via drill 0.35)
  Top 0.152: U3.11 39.49,28.3 36.08,31.72 36.08,37.68 35.1,38.66 v35.1,42.8 | IC1.15 32.75,44.35 33,44.6 33,45.8 33.2,46 34.8,46 35.1,45.7 v35.1,45
  Bottom 0.152: v35.1,45 v35.1,42.8
SCL  (via drill 0.35)
  Top 0.152: v16.15,47.24 17.07,46.33 22.86,46.33 IC1.42 | v14.48,48.92 10.67,48.92 8.38,46.63 8.08,46.63 6.86,45.41 6.86,45.11 6.1,44.35 5.33,44.35 3.35,42.37 3.35,14.33 JP5.1
  Bottom 0.152: U2.8 3.81,18.9 3.81,17.68 4.12,17.37 4.12,16.46 3.81,16.15 3.81,16 3.5,15.7 3.5,14.33 JP5.1 | v14.48,48.92 v16.15,47.24
SDA  (via drill 0.35)
  Top 0.152: v15.39,46.48 16,45.87 22.86,45.87 IC1.43 | v13.72,48.16 12.5,48.16 8.38,44.04 5.49,44.04 4.72,43.28 4.72,18.9 4.72,15.39 5.79,14.33 JP5.2
  Bottom 0.152: U2.7 4.27,18.9 4.27,18.14 4.42,17.98 4.42,17.22 5.49,16.15 5.49,16 5.79,15.7 5.79,14.33 JP5.2 | v13.72,48.16 v15.39,46.48
SWDCLK
  Top 0.152: IC1.37 23.01,48.92 29.57,48.92 30.63,49.99 30.63,59.13 28.04,61.72 JP1.3
SWDIO
  Top 0.152: IC1.34 25.76,50.75 25.76,51.82 26.21,52.27 26.21,61.11 25.6,61.72 JP1.2
VBUS
  Top 0.152: U1.6 19.96,4.12 17.22,4.12 15.09,6.25 11.6,6.25 11.2,6.65 11.2,9.1 11,9.3 8,9.3 7.55,8.85 C9.2 7.4,7.65 J1.VBUS